# EasyEDA schematic Remote_Controller.json
TITLE: Drone_Remote_Controller; REV: 1.0; Date: 2024-01-01; Sheet: 1/1; Drawn By: cjh9760; Company: CJH
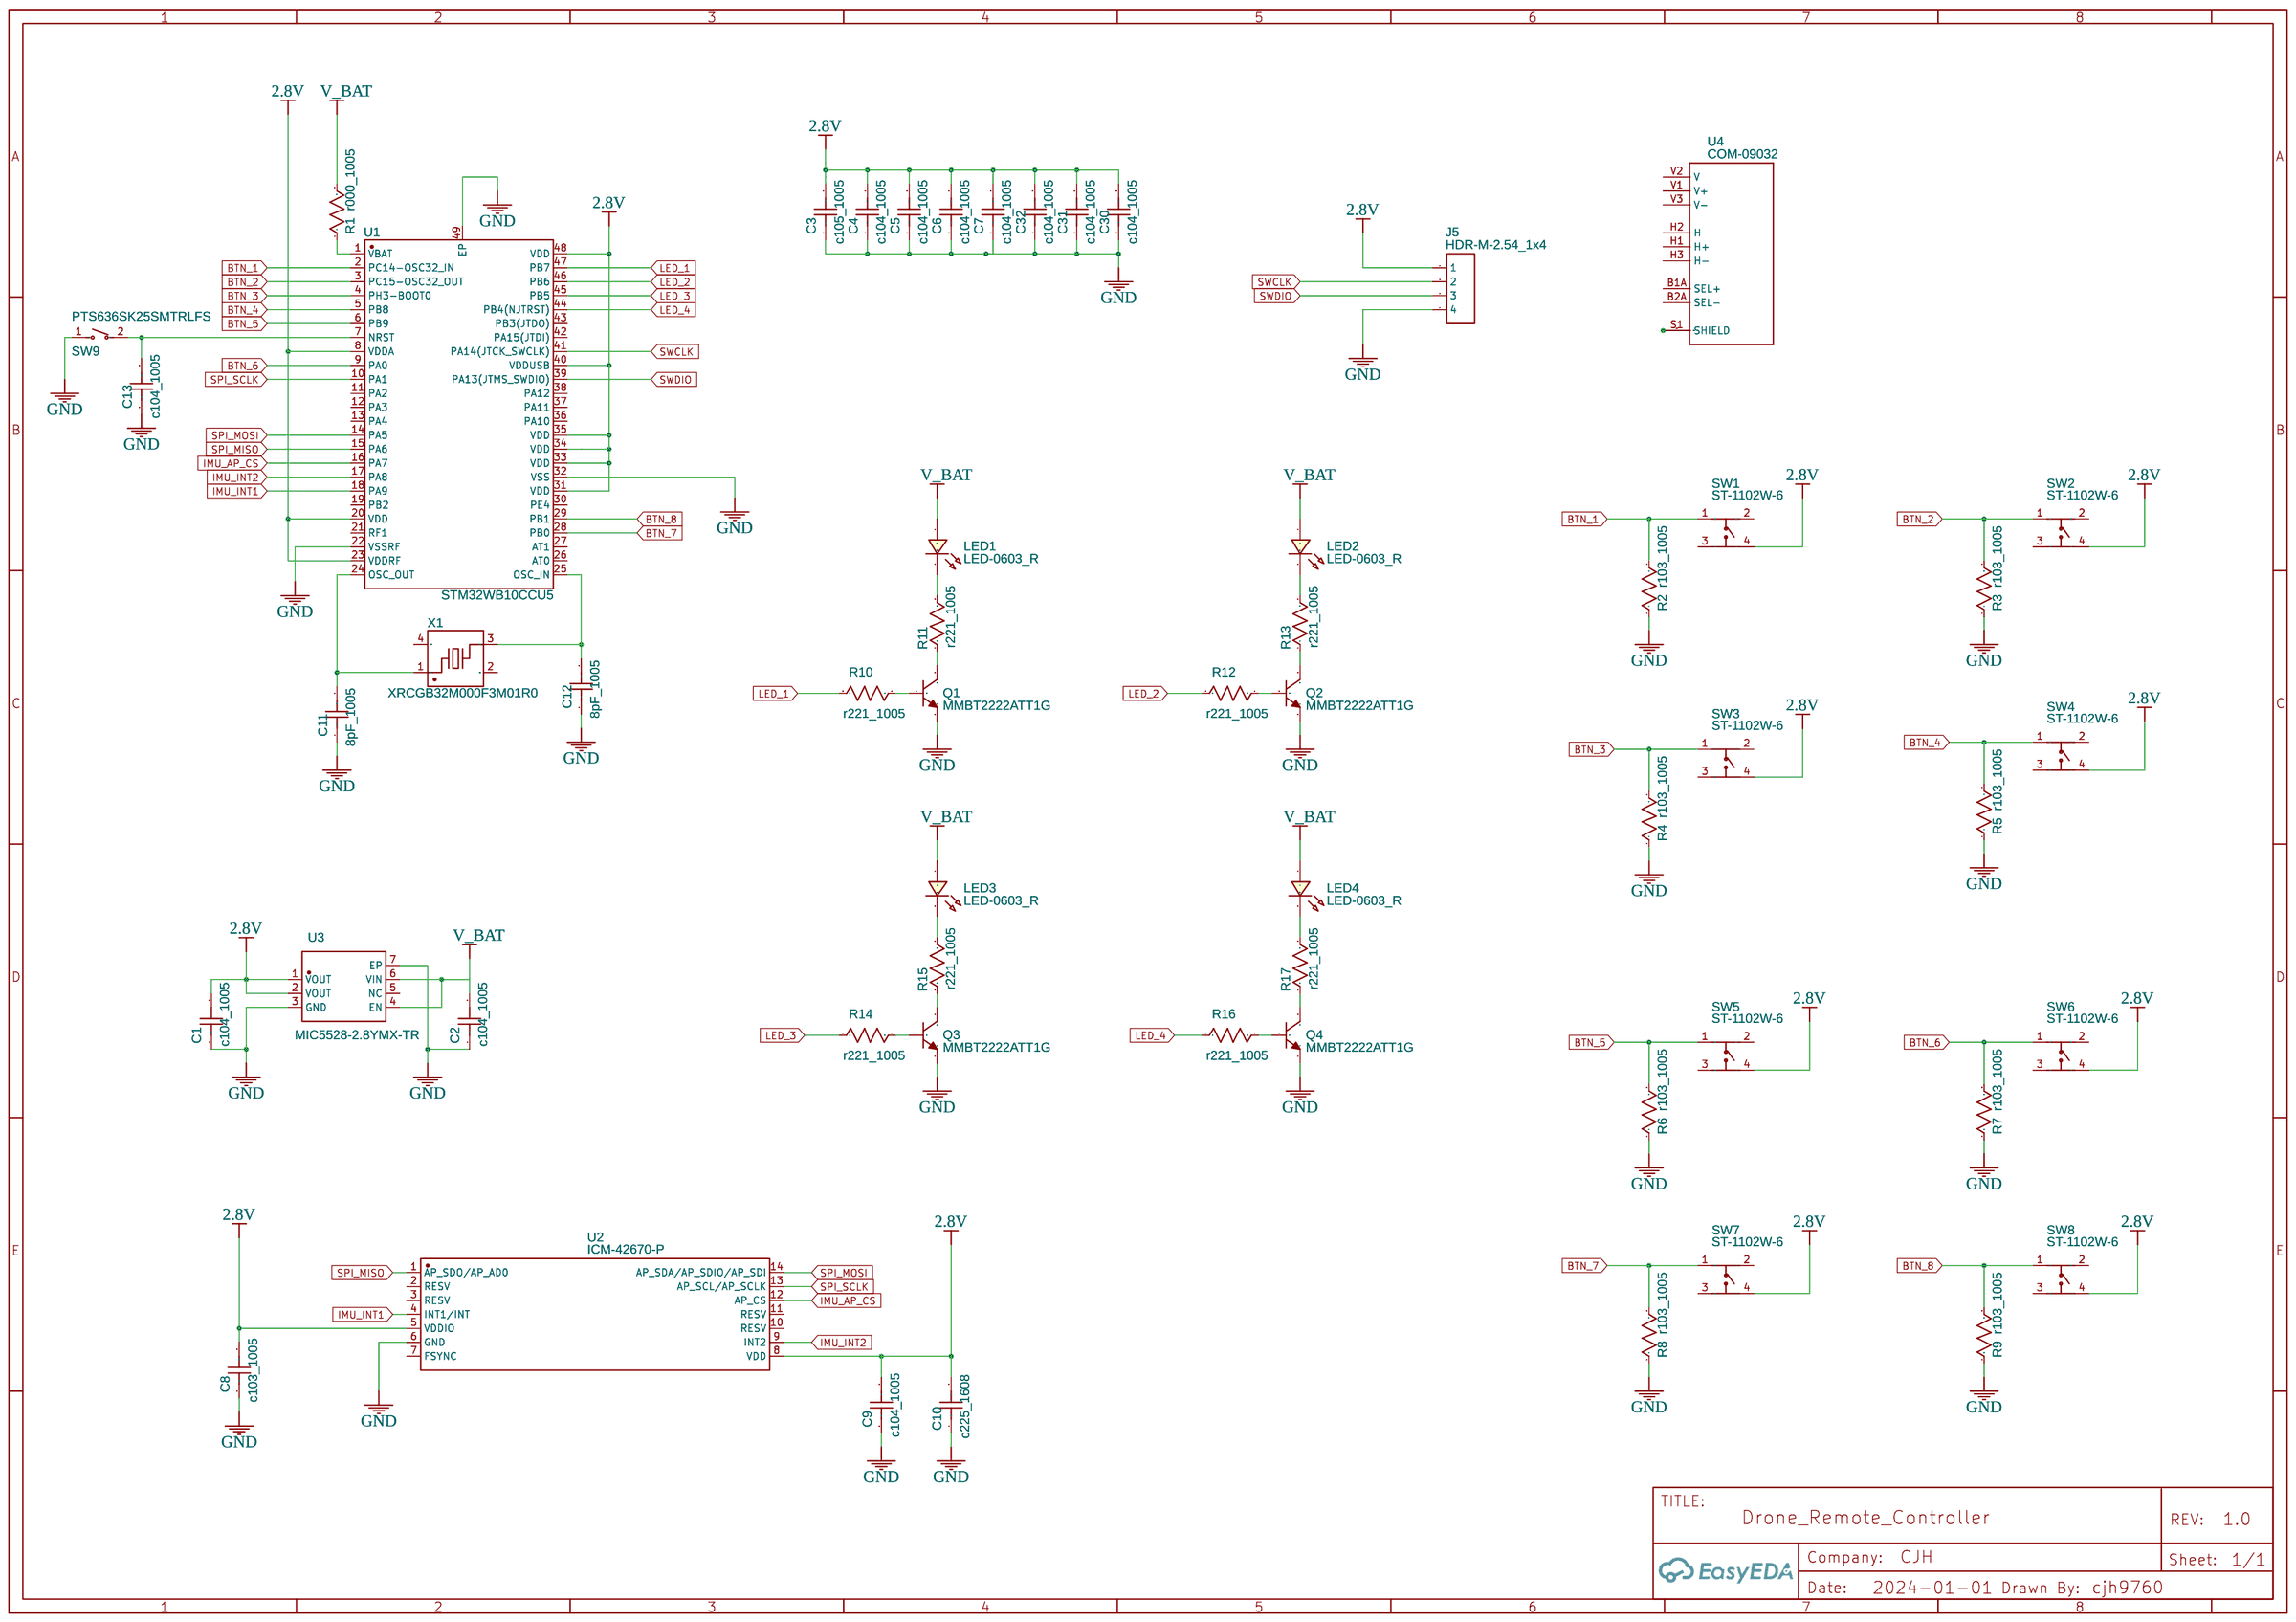
[diagram p0: schematic sheet]

## Parts
C1  c104_1005  [C0402]
C2  c104_1005  [C0402]
C3  c105_1005  [C0402]
C4  c104_1005  [C0402]
C5  c104_1005  [C0402]
C6  c104_1005  [C0402]
C7  c104_1005  [C0402]
C8  c103_1005  [C0402]
C9  c104_1005  [C0402]
C10  c225_1608  [C0603]
C11  8pF_1005  [C0402]
C12  8pF_1005  [C0402]
C13  c104_1005  [C0402]
C30  c104_1005  [C0402]
C31  c104_1005  [C0402]
C32  c104_1005  [C0402]
J5  HDR-M-2.54_1x4  [HDR-M-2.54_1X4]
LED1  LED-0603_R  [LED0603_RED]
LED2  LED-0603_R  [LED0603_RED]
LED3  LED-0603_R  [LED0603_RED]
LED4  LED-0603_R  [LED0603_RED]
Q1  MMBT2222ATT1G  [SC-75-3_L1.6-W0.8-P1.00-LS1.6-BR]
Q2  MMBT2222ATT1G  [SC-75-3_L1.6-W0.8-P1.00-LS1.6-BR]
Q3  MMBT2222ATT1G  [SC-75-3_L1.6-W0.8-P1.00-LS1.6-BR]
Q4  MMBT2222ATT1G  [SC-75-3_L1.6-W0.8-P1.00-LS1.6-BR]
R1  r000_1005  [R0402]
R2  r103_1005  [R0402]
R3  r103_1005  [R0402]
R4  r103_1005  [R0402]
R5  r103_1005  [R0402]
R6  r103_1005  [R0402]
R7  r103_1005  [R0402]
R8  r103_1005  [R0402]
R9  r103_1005  [R0402]
R10  r221_1005  [R0402]
R11  r221_1005  [R0402]
R12  r221_1005  [R0402]
R13  r221_1005  [R0402]
R14  r221_1005  [R0402]
R15  r221_1005  [R0402]
R16  r221_1005  [R0402]
R17  r221_1005  [R0402]
SW1  ST-1102W-6  [SW-SMD_4P-L6.0-W6.0-P4.50-LS9.2]
SW2  ST-1102W-6  [SW-SMD_4P-L6.0-W6.0-P4.50-LS9.2]
SW3  ST-1102W-6  [SW-SMD_4P-L6.0-W6.0-P4.50-LS9.2]
SW4  ST-1102W-6  [SW-SMD_4P-L6.0-W6.0-P4.50-LS9.2]
SW5  ST-1102W-6  [SW-SMD_4P-L6.0-W6.0-P4.50-LS9.2]
SW6  ST-1102W-6  [SW-SMD_4P-L6.0-W6.0-P4.50-LS9.2]
SW7  ST-1102W-6  [SW-SMD_4P-L6.0-W6.0-P4.50-LS9.2]
SW8  ST-1102W-6  [SW-SMD_4P-L6.0-W6.0-P4.50-LS9.2]
SW9  PTS636SK25SMTRLFS  [KEY-SMD_L6.1-W3.7-LS8.0]
U1  STM32WB10CCU5  [UFQFPN-48_L7.0-W7.0-P0.50-BL-EP]
U2  ICM-42670-P  [LGA-14_L3.0-W2.5-P0.50-TL_QMI8658A]
U3  MIC5528-2.8YMX-TR  [DFN-6_L1.2-W1.2-P0.40-TL-EP]
U4  COM-09032  [XDCR_COM-09032]
X1  XRCGB32M000F3M01R0  [CRYSTAL-SMD_4P-L2.0-W1.6-BL]

## Library data of the parts
C1-C9 C11-C13 C30-C32 = C_0402_US: Contributor: LCEDA_Lib
C10 = C_0603_US: Contributor: LCEDA_Lib
J5 = HDR-M-2.54_1x4: Supplier Part: C124378; Supplier: LCSC; Contributor: LCEDA_Lib
LED1-LED4 = LED-0603_R: Manufacturer: EVERLIGHT(台湾亿光); Manufacturer Part: 19-217/R6C-AL1M2VY/3T; Supplier Part: C72044; Supplier: LCSC; Contributor: LCEDA_01
Q1-Q4 = MMBT2222ATT1G: Supplier: LCSC; Manufacturer: onsemi(安森美); Supplier Part: C94417; JLCPCB Part Class: Extended Part
R1-R17 = R_0402_US: Contributor: LCEDA_Lib
SW1-SW8 = ST-1102W-6: Contributor: LCSC; Supplier: LCSC; Supplier Part: C589249; Manufacturer: RISHENG(日昇); JLCPCB Part Class: Extended Part
SW9 = PTS636SK25SMTRLFS: Contributor: LCSC; Supplier: LCSC; Supplier Part: C2689642; Manufacturer: C&K; JLCPCB Part Class: Extended Part
U1 = STM32WB10CCU5: Manufacturer: ST; Manufacturer Part: STM32WB10CCU UFQFPN48; Supplier Part: MOUSER; link: https://www.st.com/en/microcontrollers-microprocessors/stm32wb10cc.html; Contributor: swenzzon
U2 = ICM-42670-P: Supplier: LCSC; Supplier Part: C3288646; Manufacturer: TDK InvenSense(应美盛); JLCPCB Part Class: Extended Part; Contributor: lcsc
U3 = MIC5528-2.8YMX-TR: Contributor: lcsc; Supplier: LCSC; Supplier Part: C622489; Manufacturer: MICROCHIP(美国微芯)
U4 = COM-09032: Contributor: cjh9760
X1 = 7D016000O01: Contributor: LCSC; Supplier: LCSC; Supplier Part: C648922; Manufacturer: HD(浩都频率); JLCPCB Part Class: Extended Part

## Nets
2.8V: C1.2 C3.2 C4.2 C5.2 C6.2 C7.2 C8.2 C9.2 C10.2 C30.2 C31.2 C32.2 J5.1 SW1.4 SW2.4 SW3.4 SW4.4 SW5.4 SW6.4 SW7.4 SW8.4 U1.8(VDDA) U1.20(VDD) U1.23(VDDRF) U1.31(VDD) U1.33(VDD) U1.34(VDD) U1.35(VDD) U1.40(VDDUSB) U1.48(VDD) U2.5(VDDIO) U2.8(VDD) U3.1(VOUT) U3.2(VOUT)
GND: C1.1 C2.1 C3.1 C4.1 C5.1 C6.1 C7.1 C8.1 C9.1 C10.1 C11.1 C12.1 C13.1 C30.1 C31.1 C32.1 J5.4 Q1.2(E) Q2.2(E) Q3.2(E) Q4.2(E) R2.1 R3.1 R4.1 R5.1 R6.1 R7.1 R8.1 R9.1 SW9.1 U1.22(VSSRF) U1.32(VSS) U1.49(EP) U2.6(GND) U3.3(GND) U3.7(EP)
BTN_1: R2.2 SW1.1 U1.2(PC14-OSC32_IN)
BTN_2: R3.2 SW2.1 U1.3(PC15-OSC32_OUT)
BTN_3: R4.2 SW3.1 U1.4(PH3-BOOT0)
BTN_4: R5.2 SW4.1 U1.5(PB8)
BTN_5: R6.2 SW5.1 U1.6(PB9)
BTN_6: R7.2 SW6.1 U1.9(PA0)
BTN_7: R8.2 SW7.1 U1.28(PB0)
BTN_8: R9.2 SW8.1 U1.29(PB1)
IMU_AP_CS: U1.16(PA7) U2.12(AP_CS)
IMU_INT1: U1.18(PA9) U2.4(INT1/INT)
IMU_INT2: U1.17(PA8) U2.9(INT2)
LED_1: R10.2 U1.47(PB7)
LED_2: R12.2 U1.46(PB6)
LED_3: R14.2 U1.45(PB5)
LED_4: R16.2 U1.44(PB4(NJTRST))
SPI_MISO: U1.15(PA6) U2.1(AP_SDO/AP_AD0)
SPI_MOSI: U1.14(PA5) U2.14(AP_SDA/AP_SDIO/AP_SDI)
SPI_SCLK: U1.10(PA1) U2.13(AP_SCL/AP_SCLK)
SWCLK: J5.2 U1.41(PA14(JTCK_SWCLK))
SWDIO: J5.3 U1.39(PA13(JTMS_SWDIO))
V_BAT: C2.2 LED1.1 LED2.1 LED3.1 LED4.1 R1.2 U3.4(EN) U3.6(VIN)
Net-(C11-2): C11.2 U1.24(OSC_OUT) X1.1(IN)
Net-(C12-2): C12.2 U1.25(OSC_IN) X1.3(OUT)
Net-(C13-2): C13.2 SW9.2 U1.7(NRST)
Net-(LED1-2): LED1.2 R11.2
Net-(LED2-2): LED2.2 R13.2
Net-(LED3-2): LED3.2 R15.2
Net-(LED4-2): LED4.2 R17.2
Net-(Q1-1): Q1.1(B) R10.1
Net-(Q1-3): Q1.3(C) R11.1
Net-(Q2-1): Q2.1(B) R12.1
Net-(Q2-3): Q2.3(C) R13.1
Net-(Q3-1): Q3.1(B) R14.1
Net-(Q3-3): Q3.3(C) R15.1
Net-(Q4-1): Q4.1(B) R16.1
Net-(Q4-3): Q4.3(C) R17.1
Net-(R1-1): R1.1 U1.1(VBAT)
Net-(U4-S1): U4.S1(SHIELD) U4.S2(SHIELD) U4.S3(SHIELD) U4.S4(SHIELD)

Not connected (* = marked no-connect by the designer): SW1 2 3; SW2 2 3; SW3 2 3; SW4 2 3; SW5 2 3; SW6 2 3; SW7 2 3; SW8 2 3; U1 11(PA2) 12(PA3) 13(PA4) 19(PB2) 21(RF1) 26(AT0) 27(AT1) 30(PE4) 36(PA10) 37(PA11) 38(PA12) 42(PA15(JTDI)) 43(PB3(JTDO)); U2 2(RESV) 3(RESV) 7(FSYNC) 10(RESV) 11(RESV); U3 5(NC); U4 B1A(SEL+) B2A(SEL-) H1(H+) H2(H) H3(H-) V1(V+) V2(V) V3(V-); X1 2(GND) 4(GND)
